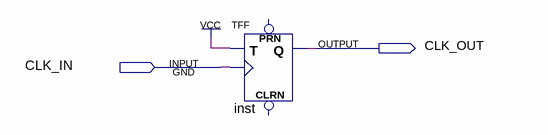
[diagram p0: schematic sheet]
// Quartus schematic CLK_conditioner.bdf as structural Verilog: 1 symbols, 2 pins
module CLK_conditioner (
  input  CLK_IN,
  output CLK_OUT
);

  TFF inst (.T(1'b1), .CLK(CLK_IN), .Q(CLK_OUT));  // open: PRN, CLRN
endmodule
